# Altium schematic sheet S3220B2.SchDoc: CPU
size A3; Revision: B; SheetNumber: 2; SheetTotal: 5
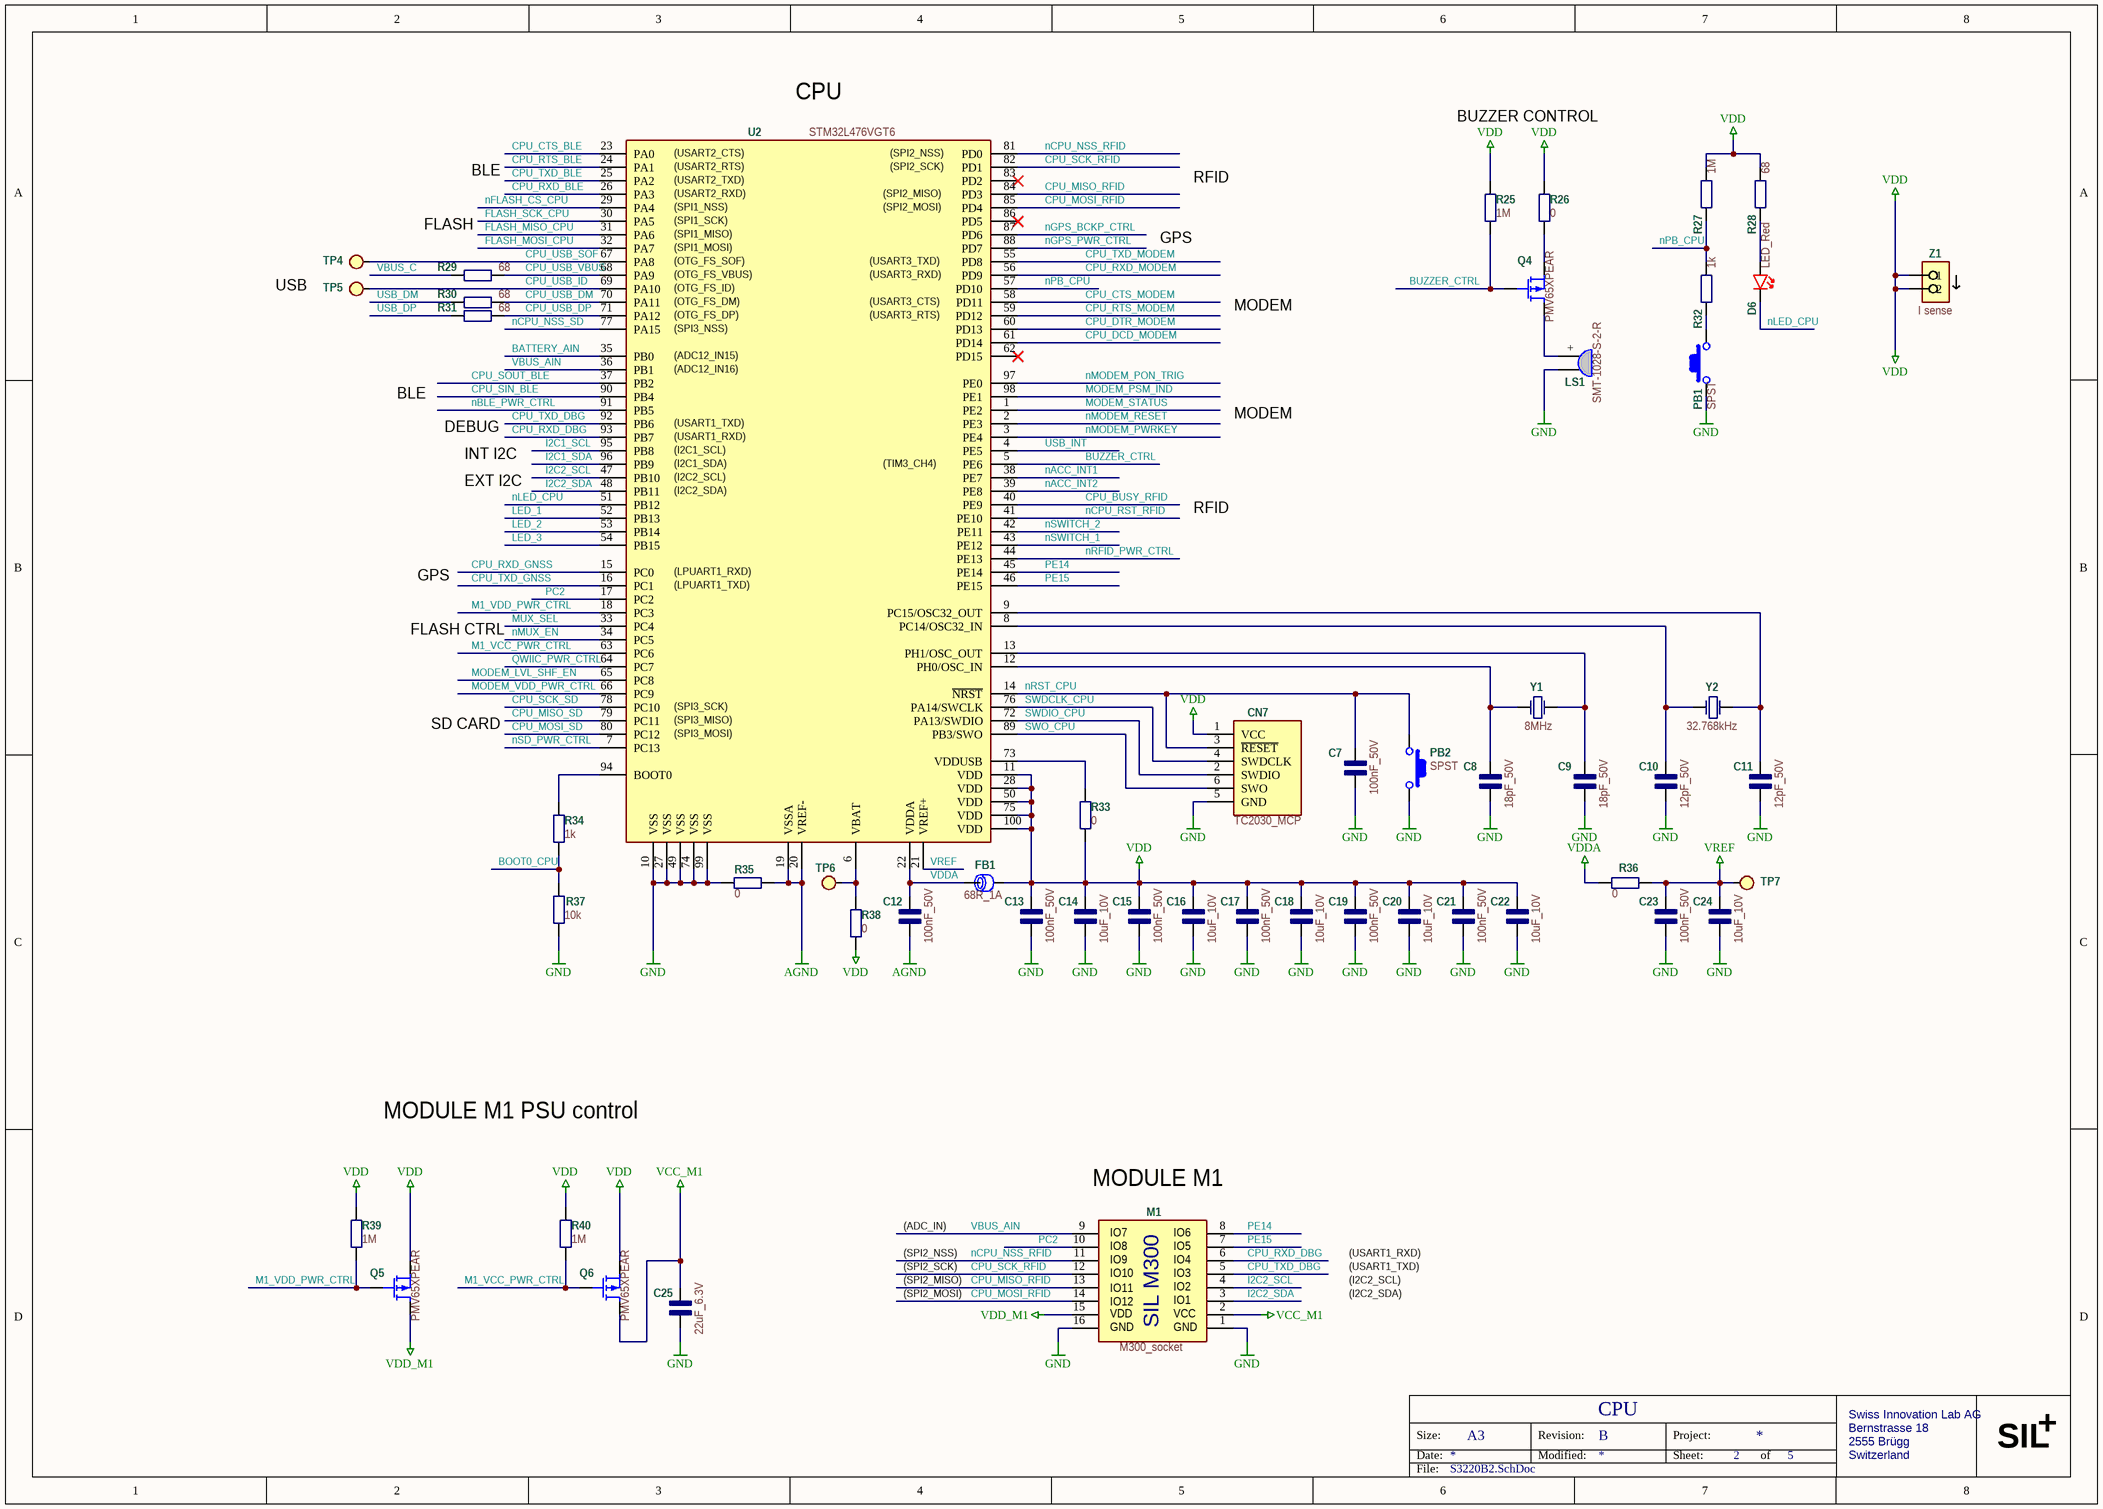
[diagram p0: S3220B2.SchDoc]

## Parts
C7  100nF_50V  [C_0603]
C8  18pF_50V  [C_0603]
C9  18pF_50V  [C_0603]
C10  12pF_50V  [C_0603]
C11  12pF_50V  [C_0603]
C12  100nF_50V  [C_0603]
C13  100nF_50V  [C_0603]
C14  10uF_10V  [C_0603]
C15  100nF_50V  [C_0603]
C16  10uF_10V  [C_0603]
C17  100nF_50V  [C_0603]
C18  10uF_10V  [C_0603]
C19  100nF_50V  [C_0603]
C20  10uF_10V  [C_0603]
C21  100nF_50V  [C_0603]
C22  10uF_10V  [C_0603]
C23  100nF_50V  [C_0603]
C24  10uF_10V  [C_0603]
C25  22uF_6.3V  [C_0603]
CN7  TC2030_MCP  [CN_TC2030-MCP-NL]  (no BOM)
D6  LED_Red  [LED_0603]
FB1  68R_1A  [L_0603]
LS1  SMT-1028-S-2-R  [LS_SMT-1028-S-2-R]
M1  M300_socket  [M_M300_socket]  (no BOM)
PB1  SPST  [PB_PTS810]
PB2  SPST  [PB_PTS810]
Q4  PMV65XPEAR  [U_SOT23-3]
Q5  PMV65XPEAR  [U_SOT23-3]
Q6  PMV65XPEAR  [U_SOT23-3]
R25  1M  [R_0603]
R26  0  [R_0603]
R27  1M  [R_0603]
R28  68  [R_0603]
R29  68  [R_0603]
R30  68  [R_0603]
R31  68  [R_0603]
R32  1k  [R_0603]
R33  0  [R_0603]
R34  1k  [R_0603]
R35  0  [R_0603]
R36  0  [R_0603]
R37  10k  [R_0603]
R38  0  [R_0603]
R39  1M  [R_0603]
R40  1M  [R_0603]
TP4  Test point  [TP_SMD_R1.0mm]  (value not drawn)  (no BOM)
TP5  Test point  [TP_SMD_R1.0mm]  (value not drawn)  (no BOM)
TP6  Test point  [TP_SMD_R1.0mm]  (value not drawn)  (no BOM)
TP7  Test point  [TP_SMD_R1.0mm]  (value not drawn)  (no BOM)
U2  STM32L476VGT6  [U_100-LQFP]
Y1  8MHz  [Y_ABMM2]
Y2  32.768kHz  [Y_XTAL-3215]
Z1  I sense  [Z_I_SENSE]  (no BOM)

## Nets
AGND: C12.1 R35.2 U2.19(VSSA) U2.20(VREF-)
GND: C7.1 C8.1 C9.1 C10.1 C11.1 C13.1 C14.1 C15.1 C16.1 C17.1 C18.1 C19.1 C20.1 C21.1 C22.1 C23.1 C24.1 C25.1 CN7.5(GND) LS1.2(-) M1.1(GND) M1.16(GND) PB1.2 PB2.1 R35.1 R37.1 U2.10(VSS) U2.27(VSS) U2.49(VSS) U2.74(VSS) U2.99(VSS)
VCC_M1: C25.2 M1.2(5V) Q6.3(D)
VDD: C13.2 C14.2 C15.2 C16.2 C17.2 C18.2 C19.2 C20.2 C21.2 C22.2 CN7.1(VCC) FB1.2 Q5.2(S) Q6.2(S) R25.2 R26.1 R27.1 R28.2 R33.2 R38.1 R39.2 R40.1 U2.11(VDD) U2.28(VDD) U2.50(VDD) U2.75(VDD) U2.100(VDD) Z1.1 Z1.2
VDD_M1: M1.15(3.3V) Q5.3(D)
VDDA: C12.2 FB1.1 R36.2 U2.22(VDDA)
VREF: C23.2 C24.2 R36.1 TP7.1 U2.21(VREF+)
BATTERY_AIN: U2.35(PB0)
BOOT0_CPU: R34.1 R37.2
BUZZER_CTRL: Q4.1(G) R25.1 U2.5(PE6)
CPU_BUSY_RFID: U2.40(PE9)
CPU_CTS_BLE: U2.23(PA0)
CPU_CTS_MODEM: U2.58(PD11)
CPU_DCD_MODEM: U2.61(PD14)
CPU_DTR_MODEM: U2.60(PD13)
CPU_MISO_RFID: M1.13(MISO) U2.84(PD3)
CPU_MISO_SD: U2.79(PC11)
CPU_MOSI_RFID: M1.14(MOSI) U2.85(PD4)
CPU_MOSI_SD: U2.80(PC12)
CPU_RTS_BLE: U2.24(PA1)
CPU_RTS_MODEM: U2.59(PD12)
CPU_RXD_BLE: U2.26(PA3)
CPU_RXD_DBG: M1.6(RX) U2.93(PB7)
CPU_RXD_GNSS: U2.15(PC0)
CPU_RXD_MODEM: U2.56(PD9)
CPU_SCK_RFID: M1.12(SCK) U2.82(PD1)
CPU_SCK_SD: U2.78(PC10)
CPU_SIN_BLE: U2.90(PB4)
CPU_SOUT_BLE: U2.37(PB2)
CPU_TXD_BLE: U2.25(PA2)
CPU_TXD_DBG: M1.5(TX) U2.92(PB6)
CPU_TXD_GNSS: U2.16(PC1)
CPU_TXD_MODEM: U2.55(PD8)
CPU_USB_DM: R30.2 U2.70(PA11)
CPU_USB_DP: R31.2 U2.71(PA12)
CPU_USB_ID: TP5.1 U2.69(PA10)
CPU_USB_SOF: TP4.1 U2.67(PA8)
CPU_USB_VBUS: R29.2 U2.68(PA9)
FLASH_MISO_CPU: U2.31(PA6)
FLASH_MOSI_CPU: U2.32(PA7)
FLASH_SCK_CPU: U2.30(PA5)
I2C1_SCL: U2.95(PB8)
I2C1_SDA: U2.96(PB9)
I2C2_SCL: M1.4(SCL) U2.47(PB10)
I2C2_SDA: M1.3(SDA) U2.48(PB11)
LED_1: U2.52(PB13)
LED_2: U2.53(PB14)
LED_3: U2.54(PB15)
M1_VCC_PWR_CTRL: Q6.1(G) R40.2 U2.63(PC6)
M1_VDD_PWR_CTRL: Q5.1(G) R39.1 U2.18(PC3)
MODEM_LVL_SHF_EN: U2.65(PC8)
MODEM_PSM_IND: U2.98(PE1)
MODEM_STATUS: U2.1(PE2)
MODEM_VDD_PWR_CTRL: U2.66(PC9)
MUX_SEL: U2.33(PC4)
nACC_INT1: U2.38(PE7)
nACC_INT2: U2.39(PE8)
nBLE_PWR_CTRL: U2.91(PB5)
nCPU_NSS_RFID: M1.11(CS) U2.81(PD0)
nCPU_NSS_SD: U2.77(PA15)
nCPU_RST_RFID: U2.41(PE10)
nFLASH_CS_CPU: U2.29(PA4)
nGPS_BCKP_CTRL: U2.87(PD6)
nGPS_PWR_CTRL: U2.88(PD7)
nLED_CPU: D6.2(K) U2.51(PB12)
nMODEM_PON_TRIG: U2.97(PE0)
nMODEM_PWRKEY: U2.3(PE4)
nMODEM_RESET: U2.2(PE3)
nMUX_EN: U2.34(PC5)
nPB_CPU: R27.2 R32.2 U2.57(PD10)
nRFID_PWR_CTRL: U2.44(PE13)
nRST_CPU: C7.2 CN7.3(~{RESET}) PB2.2 U2.14(~{NRST})
nSD_PWR_CTRL: U2.7(PC13)
nSWITCH_1: U2.43(PE12)
nSWITCH_2: U2.42(PE11)
PC2: M1.10(RST) U2.17(PC2)
PE14: M1.8(PWM) U2.45(PE14)
PE15: M1.7(INT) U2.46(PE15)
QWIIC_PWR_CTRL: U2.64(PC7)
SWDCLK_CPU: CN7.4(SWDCLK) U2.76(PA14/SWCLK)
SWDIO_CPU: CN7.2(SWDIO) U2.72(PA13/SWDIO)
SWO_CPU: CN7.6(SWO) U2.89(PB3/SWO)
USB_DM: R30.1
USB_DP: R31.1
USB_INT: U2.4(PE5)
VBUS_AIN: M1.9(AN) U2.36(PB1)
VBUS_C: R29.1
NetC8_2: C8.2 U2.12(PH0/OSC_IN) Y1.1(inp)
NetC9_2: C9.2 U2.13(PH1/OSC_OUT) Y1.3(out)
NetC10_2: C10.2 U2.8(PC14/OSC32_IN) Y2.1(inp)
NetC11_2: C11.2 U2.9(PC15/OSC32_OUT) Y2.2(out)
NetD6_1: D6.1(A) R28.1
NetLS1_1: LS1.1(+) Q4.3(D)
NetPB1_1: PB1.1 R32.1
NetQ4_2: Q4.2(S) R26.2
NetR33_1: R33.1 U2.73(VDDUSB)
NetR34_2: R34.2 U2.94(BOOT0)
NetR38_2: R38.2 TP6.1 U2.6(VBAT)

Not connected (* = marked no-connect by the designer): U2 62(PD15)* 83(PD2)* 86(PD5)*

## Notes on the sheet
- (near U2) CPU
- BLE
- (near U2) (USART2_TXD)
- (near U2) (USART2_CTS)
- (near U2) (USART2_RTS)
- (near U2) (SPI2_SCK)
- (near U2) (SPI2_NSS)
- RFID
- BUZZER CONTROL
- (near R29) FLASH
- (near U2) (USART2_RXD)
- (near U2) (SPI1_MISO)
- (near U2) (SPI1_SCK)
- (near U2) (SPI1_NSS)
- (near U2) (SPI2_MOSI)
- (near U2) (SPI2_MISO)
- GPS
- USB
- (near U2) (SPI1_MOSI)
- (near U2) (OTG_FS_DM)
- (near U2) (OTG_FS_DP)
- (near U2) (OTG_FS_SOF)
- (near U2) (OTG_FS_VBUS)
- (near U2) (OTG_FS_ID)
- (near U2) (USART3_CTS)
- (near U2) (USART3_RTS)
- (near U2) (USART3_TXD)
- (near U2) (USART3_RXD)
- MODEM
- (near U2) (SPI3_NSS)
- (near U2) (ADC12_IN15)
- (near U2) (ADC12_IN16)
- DEBUG
- (near U2) (USART1_TXD)
- (near U2) (USART1_RXD)
- (near U2) (I2C1_SCL)
- INT I2C
- EXT I2C
- (near U2) (I2C2_SCL)
- (near U2) (I2C2_SDA)
- (near U2) (I2C1_SDA)
- (near U2) (TIM3_CH4)
- (near U2) (LPUART1_TXD)
- (near U2) (LPUART1_RXD)
- FLASH CTRL
- (near U2) (SPI3_SCK)
- (near U2) (SPI3_MISO)
- SD CARD
- (near U2) (SPI3_MOSI)
- MODULE M1 PSU control
- (near M1) MODULE M1
- (SPI2_NSS)
- (ADC_IN)
- (USART1_RXD)
- (SPI2_SCK)
- (SPI2_MISO)
- (SPI2_MOSI)
- (I2C2_SCL)
- (I2C2_SDA)
- (USART1_TXD)
- Size:
- Date:
- A3
- Revision:
- Modified:
- Project:
- Sheet:
- of
- Swiss Innovation Lab AG
- Bernstrasse 18
- 2555 Brügg
- Switzerland
- SIL
- +
- File:
- (in symbol M_M300_socket) IO7; IO6; IO8; IO5; IO9; IO4; IO10; IO3; IO11; IO2; IO12; IO1; VDD; VCC; SIL M300

## Library data of the parts
C7 C12 C13 C15 C17 C19 C21 C23 = C_100nF_50V: 0.1µF ±10% 50V Ceramic Capacitor X7R 0603 (1608 Metric); Manufacturer: TDK; Manufacturer Part Number: C1608X7R1H104K080AA; Value: 100nF; ValueAux: _50V; Currency: $; Price: 0,01309; Supplier 1: Digi-Key; Supplier Part Number 1: 445-1314-6-ND
C8 C9 = C_18pF_50V: 18pF ±5% 50V Ceramic Capacitor C0G, NP0 0603 (1608 Metric); Manufacturer: KEMET; Manufacturer Part Number: C0603C180J5GACTU; ValueAux: _50V; Currency: $; Value: 18pF; Price: 0,00974; Supplier 1: Digi-Key; Supplier Part Number 1: 399-1052-1-ND
C10 C11 = C_12pF_50V: 12pF ±1% 50V Ceramic Capacitor C0G, NP0 0603 (1608 Metric); Manufacturer: Samsung Electro-Mechanics; Manufacturer Part Number: CL10C120FB8NNNC; ValueAux: _50V; Currency: $; Value: 12pF; Price: 0,05153; Supplier 1: Digi-Key; Supplier Part Number 1: 1276-2175-1-ND
C14 C16 C18 C20 C22 C24 = C_10uF_10V: 10µF ±10% 10V Ceramic Capacitor X5R 0603 (1608 Metric); Manufacturer: Murata Electronics North America; Manufacturer Part Number: GRM188R61A106KE69D; Value: 10uF; ValueAux: _10V; Currency: $; Price: 0,03994; Supplier 1: Digi-Key; Supplier Part Number 1: 490-10474-1-ND
C25 = C_22uF_6V3: 22µF ±20% 6.3V Ceramic Capacitor X5R 0603 (1608 Metric); Manufacturer: Samsung Electro-Mechanics; Manufacturer Part Number: CL10A226MQ8NRNC; Value: 22uF; ValueAux: _6.3V; Currency: $; Price: 0,04566; Supplier 1: Digi-Key; Supplier Part Number 1: 1276-1193-1-ND
CN7 = CN_TC2030: TC2030-MCP-NL; Value: TC2030; ValueAux: _MCP; Currency: $; Price: 0
D6 = D_LED_R_5mA: Red 631nm LED Indication - Discrete 2V 0603; Manufacturer: Lite-On Inc.; Manufacturer Part Number: LTST-C193KRKT-5A; ValueAux: _Red; Currency: $; Value: LED; Price: 0,07565; Supplier 1: Digi-Key; Supplier Part Number 1: 160-1830-1-ND
FB1 = FB_68R_1A: FERRITE BEAD 68 OHM 0603 1LN; Manufacturer: Laird-Signal Integrity Products; Manufacturer Part Number: MI0603J680R-10; Value: 68R; ValueAux: _1A; Currency: $; Price: 0,02658; Supplier 1: Digi-Key; Supplier Part Number 1: 240-2372-1-ND
LS1 = LS_SMT-1028-S-2-R: Buzzers Transducer, Externally Driven Electromechanical/Magnetic 3.6 V 100mA 2.83kHz 93dB @ 3.6V, 10cm Surface Mount Solder Pads; Manufacturer: PUI Audio, Inc.; Currency: $; Value: SMT-1028-S-2-R; Manufacturer Part Number: SMT-1028-S-2-R; Price: 1,99500; Supplier 1: Digi-Key; Supplier Part Number 1: 668-1531-1-ND
M1 = M_M300_socket: Module M300 motherboard socket; Manufacturer: Swiss Innovation Lab; Currency: $; Value: M300; ValueAux: _socket; Manufacturer Part Number: M300; Price: 0; Supplier 1: Swiss Innovation Lab; Supplier Part Number 1: M300
PB1 PB2 = PB_SPST_2.5mm: Tactile Switch SPST-NO Top Actuated Surface Mount; Manufacturer: C&K; Manufacturer Part Number: PTS810 SJM 250 SMTR LFS; Currency: $; Value: SPST; Price: 0,17302; Supplier 1: Digi-Key; Supplier Part Number 1: CKN10502DKR-ND
Q4-Q6 = Q_PMV65: P-Channel 20V 2.8A (Ta) 480mW (Ta), 6.25W (Tc) Surface Mount TO-236AB (SOT23); Manufacturer: Nexperia USA Inc.; Currency: $; Value: PMV65XPEAR; Manufacturer Part Number: PMV65XPEAR; Price: 0,11204; Supplier 1: Digi-Key; Supplier Part Number 1: 1727-2310-1-ND
R25 R27 R39 R40 = R_1M_1%: 1 MOhms ±1% 0.1W, 1/10W Chip Resistor 0603 (1608 Metric) Automotive AEC-Q200 Thick Film; Manufacturer: Panasonic Electronic Components; Manufacturer Part Number: ERJ-3EKF1004V; Currency: $; Value: 1M; Price: 0,01264; Supplier 1: Digi-Key; Supplier Part Number 1: P1.00MHCT-ND
R26 R33 R35 R36 R38 = R_0_1%: 0 Ohms Jumper 0.1W, 1/10W Chip Resistor 0603 (1608 Metric) Automotive AEC-Q200 Thick Film; Manufacturer: Panasonic Electronic Components; Manufacturer Part Number: ERJ-3GEY0R00V; Currency: $; Value: 0; Price: 0,00962; Supplier 1: Digi-Key; Supplier Part Number 1: P0.0GCT-ND
R28-R31 = R_68_1%: 68 Ohms ±1% 0.1W, 1/10W Chip Resistor 0603 (1608 Metric) Automotive AEC-Q200 Thick Film; Manufacturer: Panasonic Electronic Components; Manufacturer Part Number: ERJ-3EKF68R0V; Currency: $; Value: 68; Price: 0,01449; Supplier 1: Digi-Key; Supplier Part Number 1: P68.0HCT-ND
R32 R34 = R_1k_1%: 1 kOhms ±1% 0.1W, 1/10W Chip Resistor 0603 (1608 Metric) Automotive AEC-Q200 Thick Film; Manufacturer: Panasonic Electronic Components; Manufacturer Part Number: ERJ-3EKF1001V; Currency: $; Value: 1k; Price: 0,01153; Supplier 1: Digi-Key; Supplier Part Number 1: P1.00KHCT-ND
R37 = R_10k_1%: 10 kOhms ±1% 0.1W, 1/10W Chip Resistor 0603 (1608 Metric) Automotive AEC-Q200 Thick Film; Manufacturer: Panasonic Electronic Components; Manufacturer Part Number: ERJ-3EKF1002V; Currency: $; Value: 10k; Price: 0,01449; Supplier 1: Digi-Key; Supplier Part Number 1: P10.0KHCT-ND
TP4-TP7 = TP_Test_point: Manufacturer: Swiss Innovation Lab; Currency: $; Value: Test point; Manufacturer Part Number: Test point; Price: 0
U2 = U_STM32L476: ARM® Cortex®-M4 STM32L4 Microcontroller IC 32-Bit 80MHz 1MB (1M x 8) FLASH 100-LQFP (14x14); Manufacturer: STMicroelectronics; Currency: $; Value: STM32L476VGT6; Manufacturer Part Number: STM32L476VGT6; Price: 5,98590; Supplier 1: Digi-Key; Supplier Part Number 1: 497-15873-ND
Y1 = Y_8MHz_20ppm: 8MHz ±20ppm Crystal 18pF 72 Ohms 4-SMD, No Lead; Manufacturer: Abracon LLC; Manufacturer Part Number: ABMM2-8.000MHZ-E2-T; Currency: $; Value: 8MHz; Price: 0,49500; Supplier 1: Digi-Key; Supplier Part Number 1: 535-9628-1-ND
Y2 = Y_32kHz_10ppm: 32.768kHz ±10ppm Crystal 12.5pF 70 kOhms 2-SMD, No Lead; Manufacturer: ECS Inc.; Manufacturer Part Number: ECS-.327-12.5-34B-C-TR; Currency: $; Value: 32.768kHz; Price: 0,42900; Supplier 1: Digi-Key; Supplier Part Number 1: XC1968CT-ND
Z1 = Z_I_sense: 2 Positions Header Connector 0.100" (2.54mm) SMD Gold for current measurement; Manufacturer: SIL; Currency: $; Value: I sense; Manufacturer Part Number: I sense; Price: 0; Supplier 1: SIL; Supplier Part Number 1: I sense